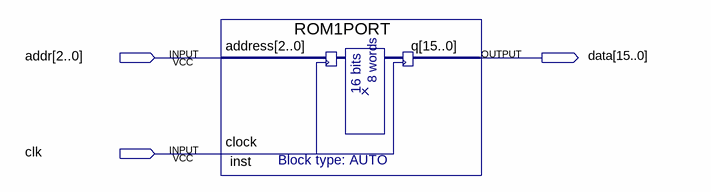
[diagram p0: schematic sheet]
// Quartus schematic ROM.bdf as structural Verilog: 1 symbols, 3 pins
module ROM (
  input  [2:0] addr,
  input  clk,
  output [15:0] data
);

  ROM1PORT inst (.address(addr), .clock(clk), .q(data));
endmodule
